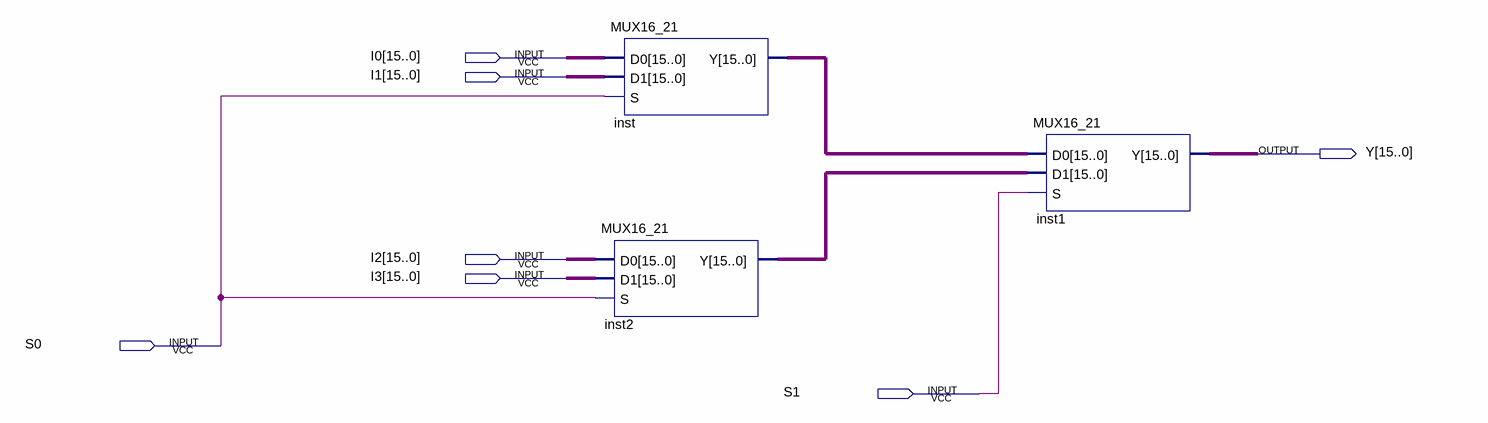
[diagram p0: schematic sheet]
// Quartus schematic MUX16_41.bdf as structural Verilog: 3 symbols, 7 pins
module MUX16_41 (
  input  [15:0] I0,
  input  [15:0] I1,
  input  [15:0] I2,
  input  [15:0] I3,
  input  S0,
  input  S1,
  output [15:0] Y
);

  wire [15:0] inst2_y, inst_y;

  MUX16_21 inst (.D0(I0), .D1(I1), .S(S0), .Y(inst_y));
  MUX16_21 inst2 (.D0(I2), .D1(I3), .S(S0), .Y(inst2_y));
  MUX16_21 inst1 (.D0(inst_y), .D1(inst2_y), .S(S1), .Y(Y));
endmodule
